# Altium schematic sheet ADF4351_PLL.SchDoc
size A3
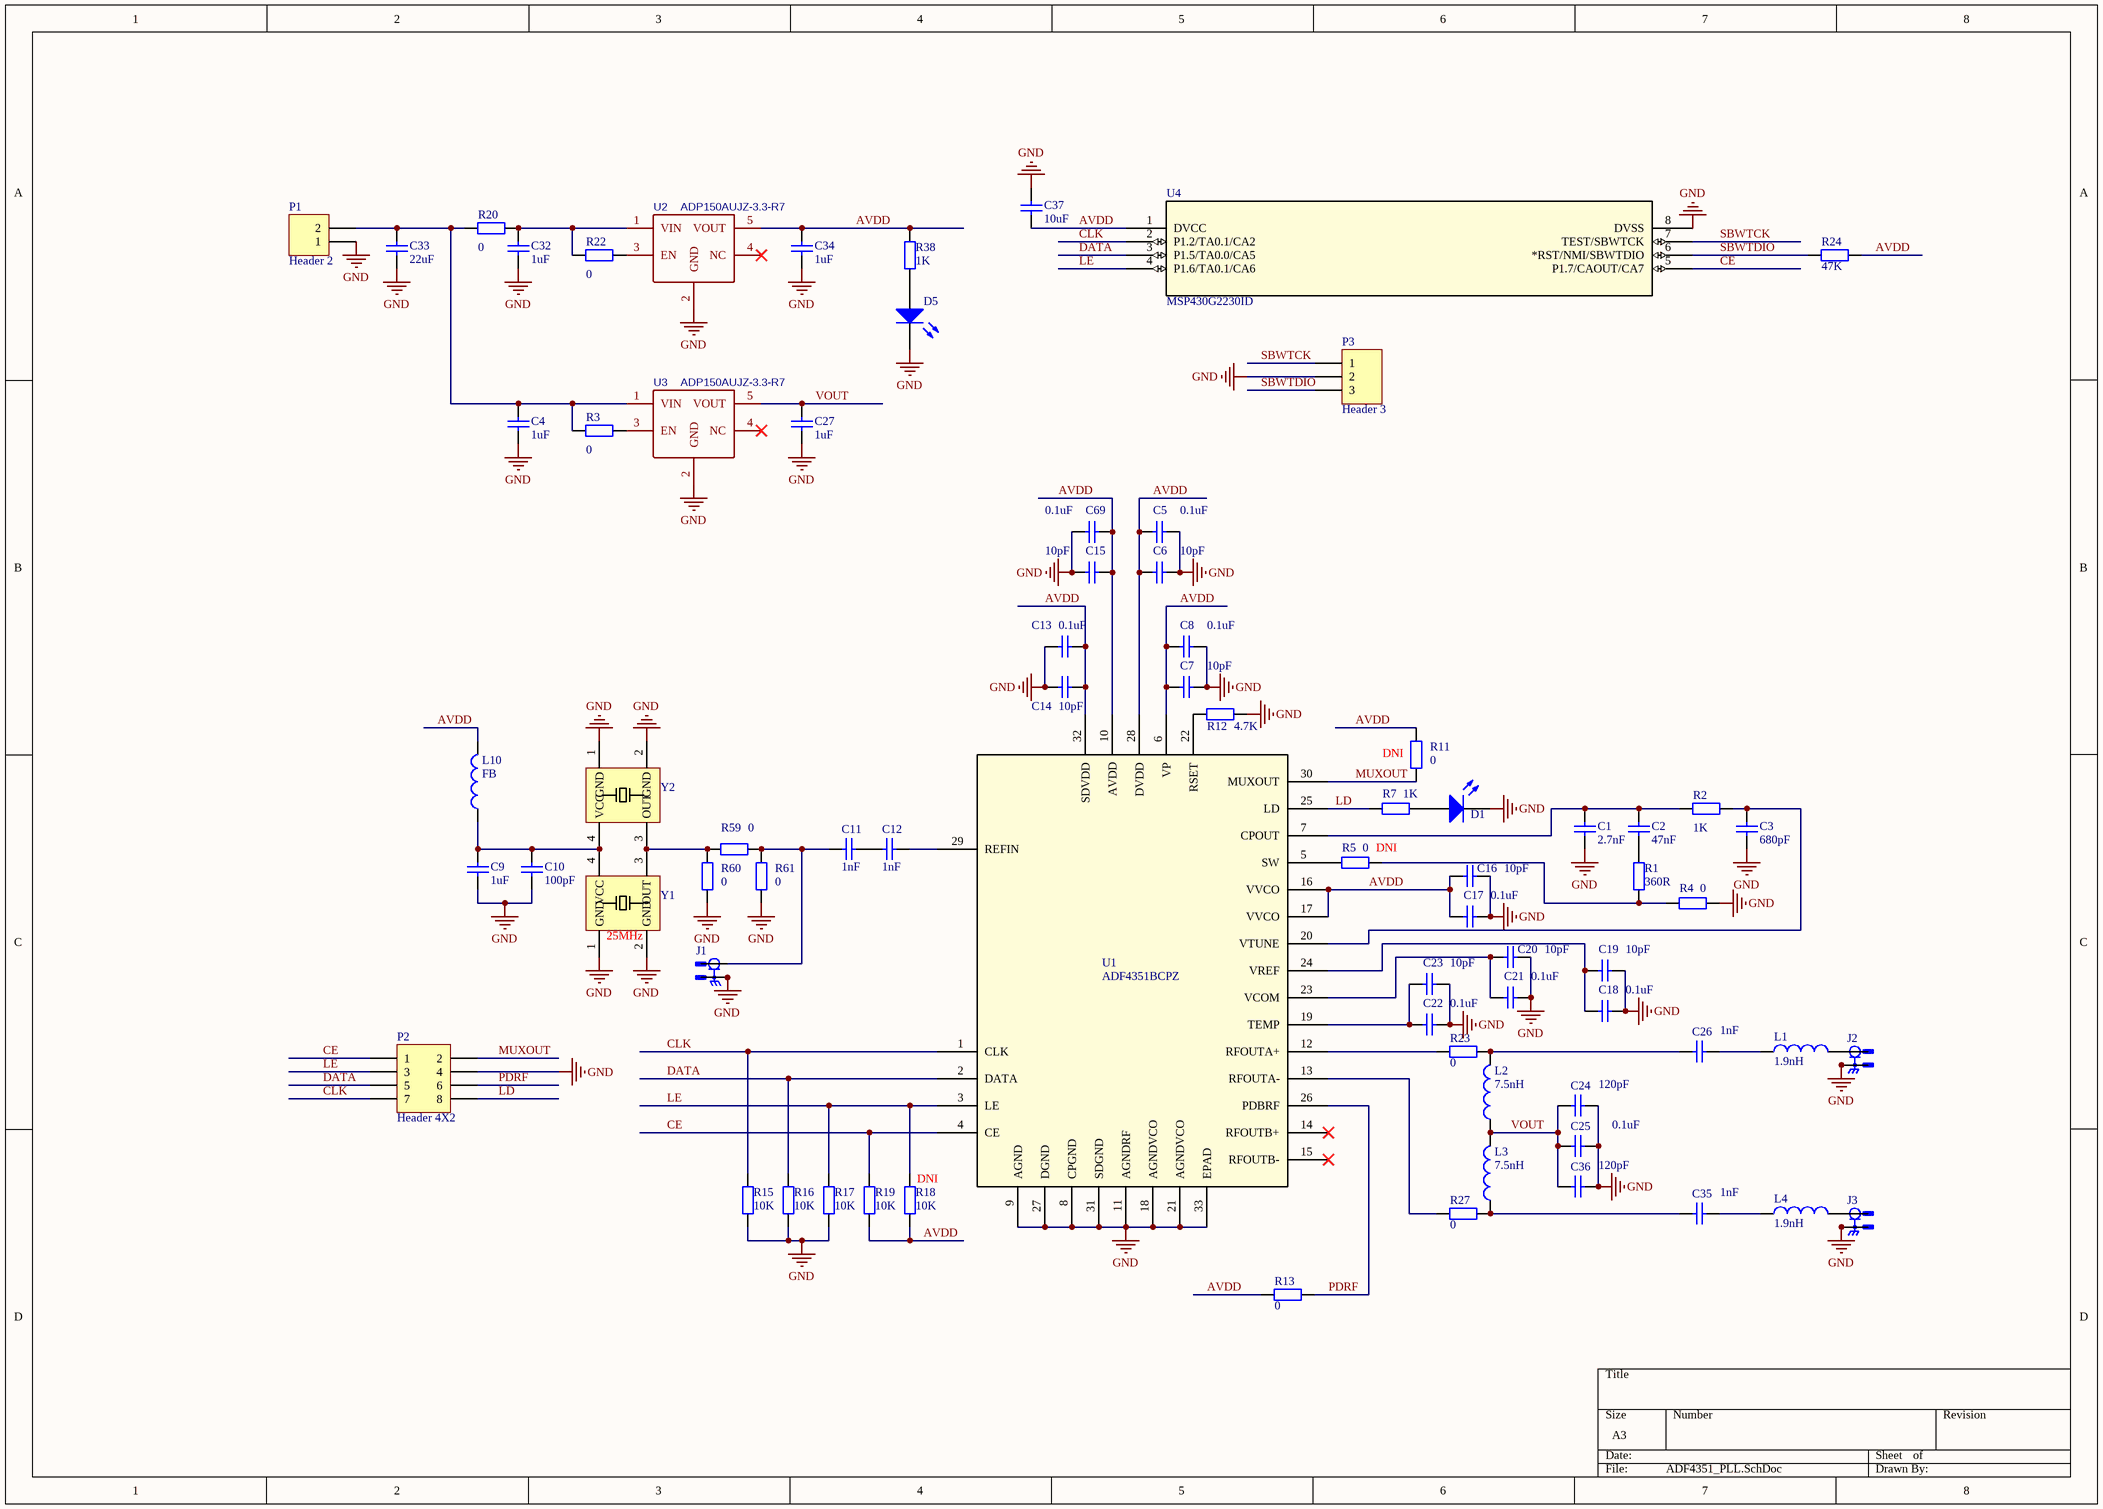
[diagram p0: ADF4351_PLL.SchDoc]

## Parts
C1  value 2.7nF  [0603E]  (hidden comment: Cap)
C2  value 47nF  [0603E]  (hidden comment: Cap)
C3  value 680pF  [0603E]  (hidden comment: Cap)
C4  value 1uF  [0603E]  (hidden comment: Cap)
C5  value 0.1uF  [0603E]  (hidden comment: Cap)
C6  value 10pF  [0603E]  (hidden comment: Cap)
C7  value 10pF  [0603E]  (hidden comment: Cap)
C8  value 0.1uF  [0603E]  (hidden comment: Cap)
C9  value 1uF  [0603E]  (hidden comment: Cap)
C10  value 100pF  [0603E]  (hidden comment: Cap)
C11  value 1nF  [0603E]  (hidden comment: Cap)
C12  value 1nF  [0603E]  (hidden comment: Cap)
C13  value 0.1uF  [0603E]  (hidden comment: Cap)
C14  value 10pF  [0603E]  (hidden comment: Cap)
C15  value 10pF  [0603E]  (hidden comment: Cap)
C16  value 10pF  [0603E]  (hidden comment: Cap)
C17  value 0.1uF  [0603E]  (hidden comment: Cap)
C18  value 0.1uF  [0603E]  (hidden comment: Cap)
C19  value 10pF  [0603E]  (hidden comment: Cap)
C20  value 10pF  [0603E]  (hidden comment: Cap)
C21  value 0.1uF  [0603E]  (hidden comment: Cap)
C22  value 0.1uF  [0603E]  (hidden comment: Cap)
C23  value 10pF  [0603E]  (hidden comment: Cap)
C24  value 120pF  [0603E]  (hidden comment: Cap)
C25  value 0.1uF  [0603E]  (hidden comment: Cap)
C26  value 1nF  [0603E]  (hidden comment: Cap)
C27  value 1uF  [0603E]  (hidden comment: Cap)
C32  value 1uF  [0603E]  (hidden comment: Cap)
C33  value 22uF  [R1206]  (hidden comment: Cap)
C34  value 1uF  [0603E]  (hidden comment: Cap)
C35  value 1nF  [0603E]  (hidden comment: Cap)
C36  value 120pF  [0603E]  (hidden comment: Cap)
C37  value 10uF  [0603E]  (hidden comment: Cap)
C69  value 0.1uF  [0603E]  (hidden comment: Cap)
D1  LED0  [0603E]  (value not drawn)
D5  LED0  [0603E]  (value not drawn)
J1  (no value)  [SMA]
J2  (no value)  [SMA]
J3  (no value)  [SMA]
L1  value 1.9nH  [0603E]  (hidden comment: Inductor)
L2  value 7.5nH  [0603E]  (hidden comment: Inductor)
L3  value 7.5nH  [0603E]  (hidden comment: Inductor)
L4  value 1.9nH  [0603E]  (hidden comment: Inductor)
L10  value FB  [0603E]  (hidden comment: Inductor)
P1  Header 2  [HDR1X2]
P2  Header 4X2  [HDR2X4]
P3  Header 3  [HDR1X3]
R1  value 360R  [0603E]  (hidden comment: Res2)
R2  value 1K  [0603E]  (hidden comment: Res2)
R3  value 0  [0603E]  (hidden comment: Res2)
R4  value 0  [0603E]  (hidden comment: Res2)
R5  value 0  [0603E]  (hidden comment: Res2)
R7  value 1K  [0603E]  (hidden comment: Res2)
R11  value 0  [0603E]  (hidden comment: Res2)
R12  value 4.7K  [0603E]  (hidden comment: Res2)
R13  value 0  [0603E]  (hidden comment: Res2)
R15  value 10K  [0603E]  (hidden comment: Res2)
R16  value 10K  [0603E]  (hidden comment: Res2)
R17  value 10K  [0603E]  (hidden comment: Res2)
R18  value 10K  [0603E]  (hidden comment: Res2)
R19  value 10K  [0603E]  (hidden comment: Res2)
R20  value 0  [0603E]  (hidden comment: Res2)
R22  value 0  [0603E]  (hidden comment: Res2)
R23  value 0  [0603E]  (hidden comment: Res2)
R24  value 47K  [0603E]  (hidden comment: Res2)
R27  value 0  [0603E]  (hidden comment: Res2)
R38  value 1K  [0603E]  (hidden comment: Res2)
R59  value 0  [0603E]  (hidden comment: Res2)
R60  value 0  [0603E]  (hidden comment: Res2)
R61  value 0  [0603E]  (hidden comment: Res2)
U1  ADF4351BCPZ  [CP-32-7_ADI]
U2  ADP150AUJZ-3.3-R7  [SOT-23-5_L3.0-W1.7-P0.95-LS2.8-BR]
U3  ADP150AUJZ-3.3-R7  [SOT-23-5_L3.0-W1.7-P0.95-LS2.8-BR]
U4  MSP430G2230ID  [D8]
Y1  DSB321SDA  [3225]  (value not drawn)
Y2  DSB321SDA  [2016]  (value not drawn)

## Nets
GND: C1.1 C3.1 C4.2 C5.2 C6.2 C7.2 C8.2 C9.2 C10.2 C13.2 C14.2 C15.2 C16.2 C17.2 C18.2 C19.2 C20.2 C21.2 C22.2 C23.2 C24.2 C25.2 C27.2 C32.2 C33.2 C34.2 C36.2 C37.2 C69.2 D1.2(K) D5.2(K) J1.S1 J1.S2 J1.S3 J1.S4 J2.S1 J2.S2 J2.S3 J2.S4 J3.S1 J3.S2 J3.S3 J3.S4 P1.1 P2.4 P3.2 R4.2 R12.1 R15.1 R16.1 R17.1 R60.1 R61.1 U1.8(CPGND) U1.9(AGND) U1.11(AGNDRF) U1.18(AGNDVCO) U1.21(AGNDVCO) U1.27(DGND) U1.31(SDGND) U1.33(EPAD) U2.2(GND) U3.2(GND) U4.8(DVSS) Y1.1(GND) Y1.2(GND) Y2.1(GND) Y2.2(GND)
AVDD: C5.1 C6.1 C7.1 C8.1 C13.1 C14.1 C15.1 C16.1 C17.1 C34.1 C37.1 C69.1 L10.2 R11.2 R13.2 R18.1 R19.1 R24.2 R38.2 U1.6(VP) U1.10(AVDD) U1.16(VVCO) U1.17(VVCO) U1.28(DVDD) U1.32(SDVDD) U2.5(VOUT) U4.1(DVCC)
CE: P2.1 R19.2 U1.4(CE) U4.5(P1.7/CAOUT/CA7)
CLK: P2.7 R15.2 U1.1(CLK) U4.2(P1.2/TA0.1/CA2)
DATA: P2.5 R16.2 U1.2(DATA) U4.3(P1.5/TA0.0/CA5)
LD: P2.8 R7.1 U1.25(LD)
LE: P2.3 R17.2 R18.2 U1.3(LE) U4.4(P1.6/TA0.1/CA6)
MUXOUT: P2.2 R11.1 U1.30(MUXOUT)
PDRF: P2.6 R13.1 U1.26(PDBRF)
SBWTCK: P3.1 U4.7(TEST/SBWTCK)
SBWTDIO: P3.3 R24.1 U4.6(*RST/NMI/SBWTDIO)
VOUT: C24.1 C25.1 C27.1 C36.1 L2.1 L3.2 U3.5(VOUT)
NetC1_2: C1.2 C2.2 R2.1 U1.7(CPOUT)
NetC2_1: C2.1 R1.2
NetC3_2: C3.2 R2.2 U1.20(VTUNE)
NetC4_1: C4.1 C33.1 P1.2 R3.1 R20.1 U3.1(VIN)
NetC9_1: C9.1 C10.1 L10.1 Y1.4(VCC) Y2.4(VCC)
NetC11_1: C11.1 J1.1 R59.2 R61.2
NetC11_2: C11.2 C12.1
NetC12_2: C12.2 U1.29(REFIN)
NetC18_1: C18.1 C19.1 U1.24(VREF)
NetC20_1: C20.1 C21.1 U1.23(VCOM)
NetC22_1: C22.1 C23.1 U1.19(TEMP)
NetC26_1: C26.1 L2.2 R23.1
NetC26_2: C26.2 L1.1
NetC32_1: C32.1 R20.2 R22.1 U2.1(VIN)
NetC35_1: C35.1 L3.1 R27.1
NetC35_2: C35.2 L4.1
NetD1_1: D1.1(A) R7.2
NetD5_1: D5.1(A) R38.1
NetJ2_1: J2.1 L1.2
NetJ3_1: J3.1 L4.2
NetR1_1: R1.1 R4.1 R5.2
NetR3_2: R3.2 U3.3(EN)
NetR5_1: R5.1 U1.5(SW)
NetR12_2: R12.2 U1.22(RSET)
NetR22_2: R22.2 U2.3(EN)
NetR23_2: R23.2 U1.12(RFOUTA+)
NetR27_2: R27.2 U1.13(RFOUTA-)
NetR59_1: R59.1 R60.2 Y1.3(OUT) Y2.3(OUT)

Not connected (* = marked no-connect by the designer): U1 14(RFOUTB+)* 15(RFOUTB-)*; U2 4(NC)*; U3 4(NC)*

## Notes on the sheet
- (near R11) DNI
- (near R5) DNI
- (near Y1) 25MHz
- (near R18) DNI

## Library data of the parts
C1-C27 C32-C37 C69 = Cap: Capacitor; Published: 8-Jun-2000; LatestRevisionDate: 17-Jul-2002; LatestRevisionNote: Re-released for DXP Platform.; PackageReference: RAD-0.3; Publisher: Altium Limited; PackageDescription: Radial Cap, Thru-Hole; 2 Leads; 0.3 in Pin Spacing
D1 D5 = LED0: Typical INFRARED GaAs LED; Published: 8-Jun-2000; LatestRevisionDate: 08-Jul-2005; LatestRevisionNote: Mech Layer 1 removed.; PackageReference: LED-0; Publisher: Altium Limited; PackageDescription: LED; 2 Leads
J1-J3 = CONSMA013.031: SMA Connector Plug, Male Pin 50Ohm Board Edge, End Launch; Panel Mount Solder; MF: Linx; Price: None; Check_prices: https://www.snapeda.com/parts/CONSMA013.031/Linx/view-part/5842273/?ref=eda; Value: *; SnapEDA_Link: https://www.snapeda.com/parts/CONSMA013.031/Linx/view-part/5842273/?ref=snap; Availability: In Stock; MP: CONSMA013.031; Package: None
L1-L4 L10 = Inductor: Code_IEC: 1005; Published: 8-Jun-2000; LatestRevisionDate: 29-May-2009; LatestRevisionNote: IPC-7351 Footprint Added.; PackageReference: 0402-A; Publisher: Altium Limited; PackageDescription: Chip Inductor; Code_JEITA: 0402
P1 = Header 2: Header, 2-Pin; LatestRevisionDate: 17-Jul-2002; LatestRevisionNote: Re-released for DXP Platform.; Publisher: Altium Limited
P2 = Header 4X2: Header, 4-Pin, Dual row; LatestRevisionDate: 17-Jul-2002; LatestRevisionNote: Re-released for DXP Platform.; Publisher: Altium Limited
P3 = Header 3: Header, 3-Pin; LatestRevisionDate: 17-Jul-2002; LatestRevisionNote: Re-released for DXP Platform.; Publisher: Altium Limited
R1-R5 R7 R11-R13 R15-R20 R22-R24 R27 R38 R59-R61 = Res2: Resistor; Published: 8-Jun-2000; LatestRevisionDate: 17-Jul-2002; LatestRevisionNote: Re-released for DXP Platform.; PackageReference: AXIAL-0.4; Publisher: Altium Limited; PackageDescription: Axial Device, Thru-Hole; 2 Leads; 0.4 in Pin Spacing
U1 = ADF4351BCPZ: No Description Available; Copyright: Copyright (C) 2021 Accelerated Designs. All rights reserved; RefDes: RefDes; Type: DEV
U2 U3 = ADP150AUJZ-3.3-R7: BOM_Manufacturer: ADI; BOM_Supplier: LCSC; BOM_Manufacturer Part: ADP150AUJZ-3.3-R7; BOM_Supplier Part: C29149; BOM_JLCPCB Part Class: Extended Part; spicePre: U; spiceSymbolName: ADP150AUJZ-3.3-R7
U4 = MSP430G2230ID: No Description Available; Mfr_Name: Texas Instruments; Copyright: Copyright (C) 2022 Ultra Librarian. All rights reserved.; Manufacturer_Part_Number: MSP430G2230ID; RefDes: RefDes; Type: DEV